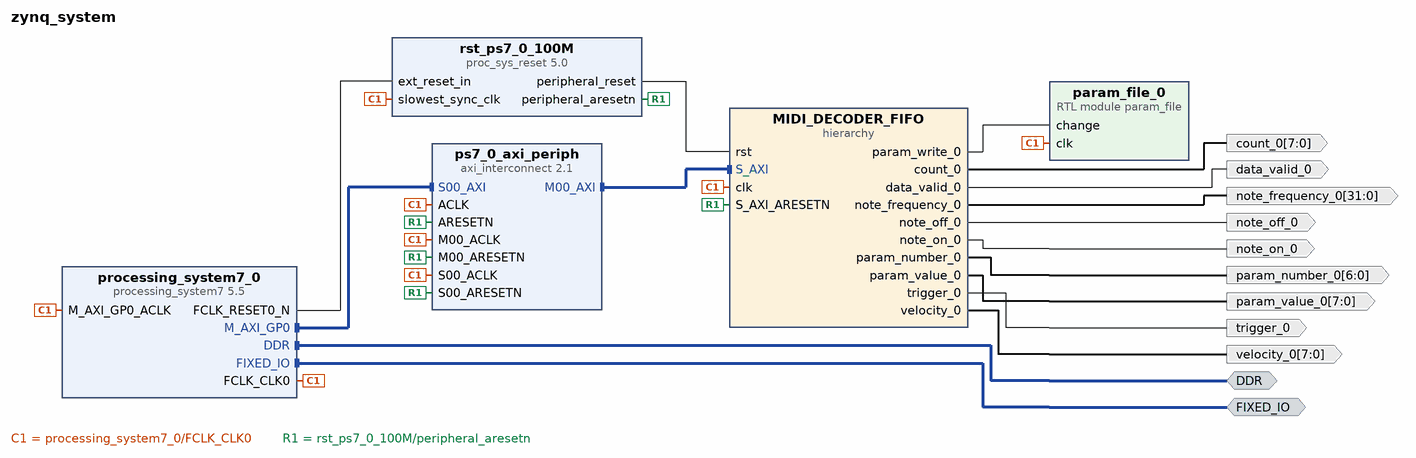
[diagram p0: block diagram of the top level]
# Vivado block design zynq_system, xc7z020clg400-1, Vivado 2021.1
create_bd_design zynq_system

create_bd_intf_port -mode Master -vlnv xilinx.com:interface:ddrx_rtl:1.0 DDR
create_bd_intf_port -mode Master -vlnv xilinx.com:display_processing_system7:fixedio_rtl:1.0 FIXED_IO
create_bd_port -dir O data_valid_0
create_bd_port -dir O -from 31 -to 0 note_frequency_0
create_bd_port -dir O note_off_0
create_bd_port -dir O note_on_0
create_bd_port -dir O -from 6 -to 0 param_number_0
create_bd_port -dir O -from 7 -to 0 param_value_0
create_bd_port -dir O trigger_0
create_bd_port -dir O -from 7 -to 0 velocity_0
create_bd_port -dir O -from 7 -to 0 -type data count_0

create_bd_cell -type ip -vlnv xilinx.com:ip:processing_system7:5.5 processing_system7_0
set_property -dict [list \
  CONFIG.PCW_FPGA0_PERIPHERAL_FREQMHZ 100 \
  CONFIG.PCW_M_AXI_GP0_ENABLE_STATIC_REMAP 1 \
  CONFIG.PCW_M_AXI_GP0_THREAD_ID_WIDTH 6 \
  CONFIG.PCW_UART1_PERIPHERAL_ENABLE 1 \
  CONFIG.PCW_UART1_UART1_IO {MIO 48 .. 49} \
  CONFIG.PCW_UART_PERIPHERAL_FREQMHZ 100 \
  CONFIG.PCW_UIPARAM_GENERATE_SUMMARY NONE \
] [get_bd_cells processing_system7_0]
# 49 more settings of processing_system7_0 are not shown: defaults, MIO pin electricals, DDR timing, and values the tool derives
create_bd_cell -type ip -vlnv xilinx.com:ip:axi_interconnect:2.1 ps7_0_axi_periph
set_property -dict [list \
  CONFIG.ENABLE_ADVANCED_OPTIONS 0 \
  CONFIG.M00_SECURE 1 \
  CONFIG.NUM_MI 1 \
  CONFIG.S00_HAS_DATA_FIFO 0 \
  CONFIG.S00_HAS_REGSLICE 3 \
] [get_bd_cells ps7_0_axi_periph]
create_bd_cell -type ip -vlnv xilinx.com:ip:proc_sys_reset:5.0 rst_ps7_0_100M
create_bd_cell -type hier MIDI_DECODER_FIFO
create_bd_cell -type module -reference param_file param_file_0

# ---- hierarchy /MIDI_DECODER_FIFO ----
current_bd_instance /MIDI_DECODER_FIFO
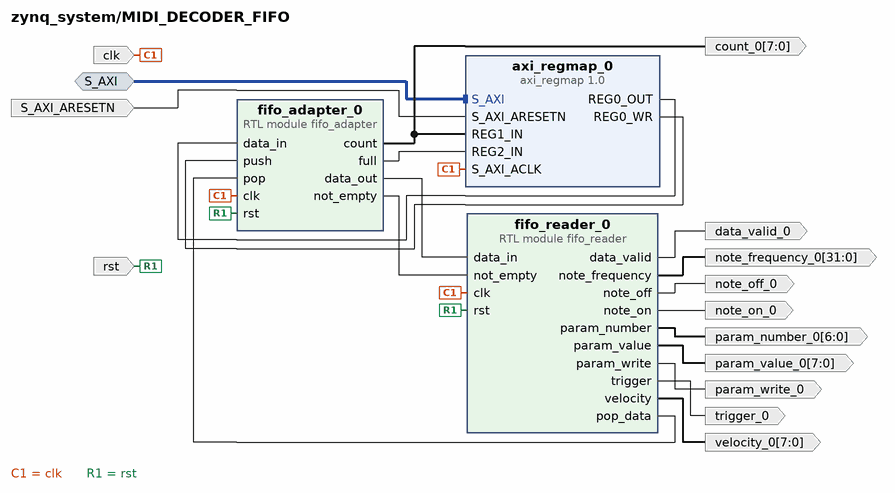
[diagram p1: block diagram inside /MIDI_DECODER_FIFO]
create_bd_intf_pin -mode Slave -vlnv xilinx.com:interface:aximm_rtl:1.0 S_AXI
create_bd_pin -dir O -from 7 -to 0 count_0
create_bd_pin -dir I -type clk clk
create_bd_pin -dir I -type rst S_AXI_ARESETN
create_bd_pin -dir I -type rst rst
create_bd_pin -dir O data_valid_0
create_bd_pin -dir O trigger_0
create_bd_pin -dir O -from 31 -to 0 note_frequency_0
create_bd_pin -dir O -from 7 -to 0 velocity_0
create_bd_pin -dir O note_on_0
create_bd_pin -dir O note_off_0
create_bd_pin -dir O param_write_0
create_bd_pin -dir O -from 6 -to 0 param_number_0
create_bd_pin -dir O -from 7 -to 0 param_value_0

create_bd_cell -type ip -vlnv SHREC:SHREC:axi_regmap:1.0 axi_regmap_0
set_property -dict {CONFIG.NUM_REGS 3 CONFIG.WIDTH0 16 CONFIG.WIDTH1 8 CONFIG.WIDTH2 1} [get_bd_cells axi_regmap_0]
create_bd_cell -type module -reference fifo_adapter fifo_adapter_0
create_bd_cell -type module -reference fifo_reader fifo_reader_0

# ---- connections ----

current_bd_instance /MIDI_DECODER_FIFO
connect_bd_intf_net [get_bd_intf_pins S_AXI] [get_bd_intf_pins axi_regmap_0/S_AXI]
connect_bd_net [get_bd_pins axi_regmap_0/REG0_OUT] [get_bd_pins fifo_adapter_0/data_in]
connect_bd_net [get_bd_pins axi_regmap_0/REG0_WR] [get_bd_pins fifo_adapter_0/push]
connect_bd_net [get_bd_pins fifo_adapter_0/count] [get_bd_pins count_0] [get_bd_pins axi_regmap_0/REG1_IN]
connect_bd_net [get_bd_pins fifo_adapter_0/data_out] [get_bd_pins fifo_reader_0/data_in]
connect_bd_net [get_bd_pins fifo_adapter_0/full] [get_bd_pins axi_regmap_0/REG2_IN]
connect_bd_net [get_bd_pins fifo_adapter_0/not_empty] [get_bd_pins fifo_reader_0/not_empty]
connect_bd_net [get_bd_pins fifo_reader_0/data_valid] [get_bd_pins data_valid_0]
connect_bd_net [get_bd_pins fifo_reader_0/note_frequency] [get_bd_pins note_frequency_0]
connect_bd_net [get_bd_pins fifo_reader_0/note_off] [get_bd_pins note_off_0]
connect_bd_net [get_bd_pins fifo_reader_0/note_on] [get_bd_pins note_on_0]
connect_bd_net [get_bd_pins fifo_reader_0/param_number] [get_bd_pins param_number_0]
connect_bd_net [get_bd_pins fifo_reader_0/param_value] [get_bd_pins param_value_0]
connect_bd_net [get_bd_pins fifo_reader_0/param_write] [get_bd_pins param_write_0]
connect_bd_net [get_bd_pins fifo_reader_0/pop_data] [get_bd_pins fifo_adapter_0/pop]
connect_bd_net [get_bd_pins fifo_reader_0/trigger] [get_bd_pins trigger_0]
connect_bd_net [get_bd_pins fifo_reader_0/velocity] [get_bd_pins velocity_0]
connect_bd_net -net processing_system7_0_FCLK_CLK0 [get_bd_pins clk] \
  [get_bd_pins fifo_adapter_0/clk] [get_bd_pins axi_regmap_0/S_AXI_ACLK] [get_bd_pins fifo_reader_0/clk]
connect_bd_net -net rst_ps7_0_100M_peripheral_aresetn [get_bd_pins S_AXI_ARESETN] [get_bd_pins axi_regmap_0/S_AXI_ARESETN]
connect_bd_net -net rst_ps7_0_100M_peripheral_reset [get_bd_pins rst] [get_bd_pins fifo_adapter_0/rst] [get_bd_pins fifo_reader_0/rst]

current_bd_instance /
connect_bd_intf_net [get_bd_intf_ports DDR] [get_bd_intf_pins processing_system7_0/DDR]
connect_bd_intf_net [get_bd_intf_ports FIXED_IO] [get_bd_intf_pins processing_system7_0/FIXED_IO]
connect_bd_intf_net [get_bd_intf_pins processing_system7_0/M_AXI_GP0] [get_bd_intf_pins ps7_0_axi_periph/S00_AXI]
connect_bd_intf_net [get_bd_intf_pins ps7_0_axi_periph/M00_AXI] [get_bd_intf_pins MIDI_DECODER_FIFO/S_AXI]
connect_bd_net -net fifo_adapter_0_count [get_bd_pins MIDI_DECODER_FIFO/count_0] [get_bd_ports count_0]
connect_bd_net -net fifo_reader_0_data_valid [get_bd_pins MIDI_DECODER_FIFO/data_valid_0] [get_bd_ports data_valid_0]
connect_bd_net -net fifo_reader_0_note_frequency [get_bd_pins MIDI_DECODER_FIFO/note_frequency_0] [get_bd_ports note_frequency_0]
connect_bd_net -net fifo_reader_0_note_off [get_bd_pins MIDI_DECODER_FIFO/note_off_0] [get_bd_ports note_off_0]
connect_bd_net -net fifo_reader_0_note_on [get_bd_pins MIDI_DECODER_FIFO/note_on_0] [get_bd_ports note_on_0]
connect_bd_net -net fifo_reader_0_param_number [get_bd_pins MIDI_DECODER_FIFO/param_number_0] [get_bd_ports param_number_0]
connect_bd_net -net fifo_reader_0_param_value [get_bd_pins MIDI_DECODER_FIFO/param_value_0] [get_bd_ports param_value_0]
connect_bd_net -net fifo_reader_0_param_write [get_bd_pins MIDI_DECODER_FIFO/param_write_0] [get_bd_pins param_file_0/change]
connect_bd_net -net fifo_reader_0_trigger [get_bd_pins MIDI_DECODER_FIFO/trigger_0] [get_bd_ports trigger_0]
connect_bd_net -net fifo_reader_0_velocity [get_bd_pins MIDI_DECODER_FIFO/velocity_0] [get_bd_ports velocity_0]
connect_bd_net [get_bd_pins processing_system7_0/FCLK_CLK0] \
  [get_bd_pins ps7_0_axi_periph/M00_ACLK] [get_bd_pins rst_ps7_0_100M/slowest_sync_clk] \
  [get_bd_pins ps7_0_axi_periph/S00_ACLK] [get_bd_pins ps7_0_axi_periph/ACLK] \
  [get_bd_pins processing_system7_0/M_AXI_GP0_ACLK] [get_bd_pins MIDI_DECODER_FIFO/clk] [get_bd_pins param_file_0/clk]
connect_bd_net [get_bd_pins processing_system7_0/FCLK_RESET0_N] [get_bd_pins rst_ps7_0_100M/ext_reset_in]
connect_bd_net [get_bd_pins rst_ps7_0_100M/peripheral_aresetn] \
  [get_bd_pins ps7_0_axi_periph/M00_ARESETN] [get_bd_pins ps7_0_axi_periph/S00_ARESETN] \
  [get_bd_pins ps7_0_axi_periph/ARESETN] [get_bd_pins MIDI_DECODER_FIFO/S_AXI_ARESETN]
connect_bd_net [get_bd_pins rst_ps7_0_100M/peripheral_reset] [get_bd_pins MIDI_DECODER_FIFO/rst]
set_property PFM.AXI_PORT {M_AXI_GP1 {memport "M_AXI_GP" sptag "" memory "" is_range "false"}} [get_bd_cells processing_system7_0]
set_property PFM.CLOCK {FCLK_CLK0 {id "1" is_default "true" proc_sys_reset "/rst_ps7_0_100M" status "fixed" freq_hz "100000000"}} [get_bd_cells processing_system7_0]

# ---- address map ----
assign_bd_address -offset 0x43C00000 -range 64K -target_address_space [get_bd_addr_spaces processing_system7_0/Data] [get_bd_addr_segs MIDI_DECODER_FIFO/axi_regmap_0/S_AXI/reg0]

validate_bd_design
save_bd_design
